# EAGLE schematic node6.9.14-frontend (EAGLE 5.10)
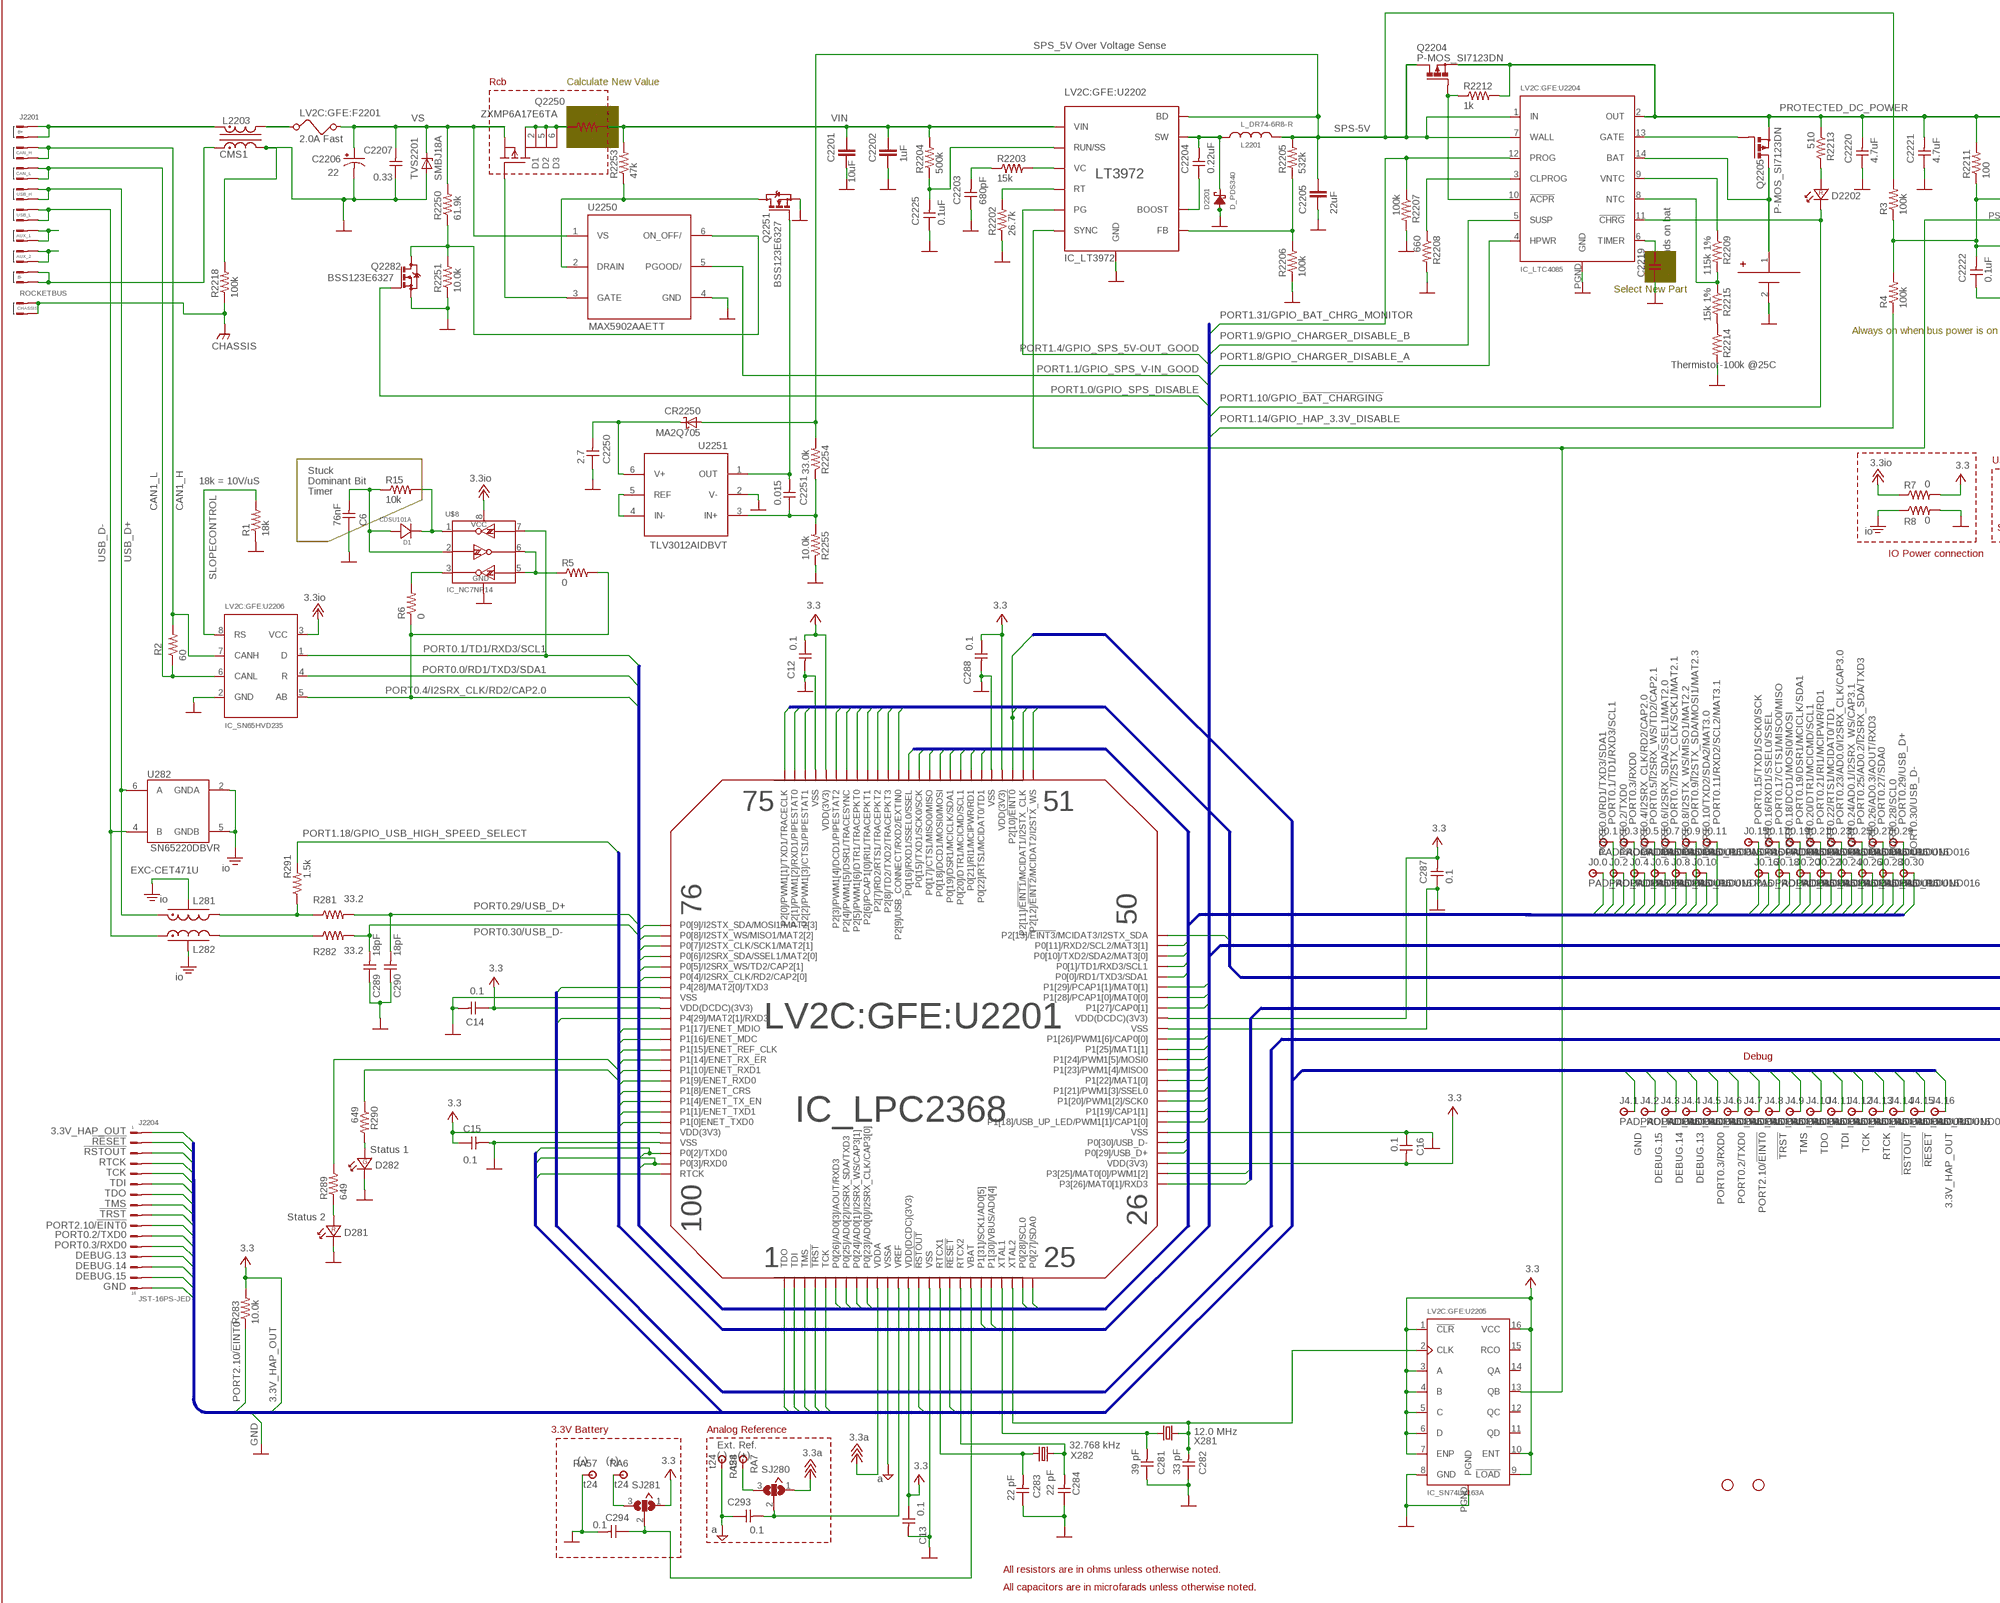
[diagram p0: schematic, sheet 1, part 1 of 2]
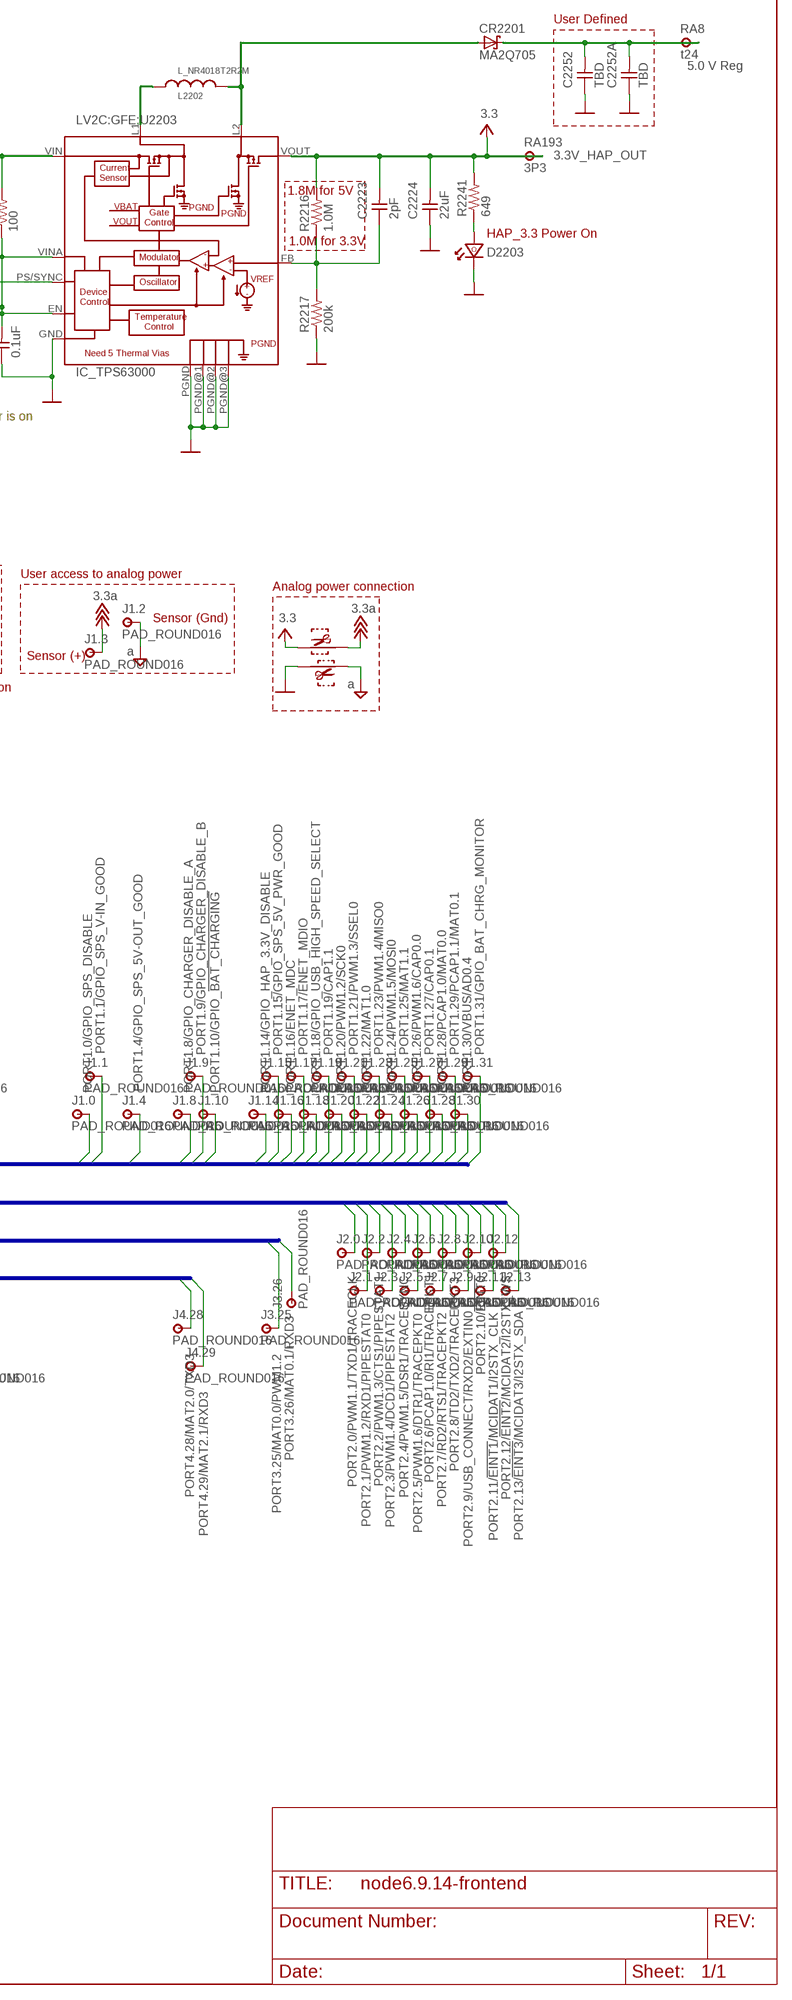
[diagram p1: schematic, sheet 1, part 2 of 2]

## Parts
B1  BATTERY_SINGLE_CELL_2MM  [2MM-1X2-HEADER]
C6  76nF  CAP-NP0805  [C0805]
C12  0.1  CAP-NP0603  [C0603]
C13  0.1  CAP-NP0603  [C0603]
C14  0.1  CAP-NP0603  [C0603]
C15  0.1  CAP-NP0603  [C0603]
C16  0.1  CAP-NP0603  [C0603]
C281  39 pF  CAP-NP0603  [C0603]
C282  33 pF  CAP-NP0603  [C0603]
C283  22 pF  CAP-NP0603  [C0603]
C284  22 pF  CAP-NP0603  [C0603]
C287  0.1  CAP-NP0603  [C0603]
C288  0.1  CAP-NP0603  [C0603]
C289  18pF  CAP-NP0603  [C0603]
C290  18pF  CAP-NP0603  [C0603]
C293  0.1  CAP-NP0603  [C0603]
C294  0.1  CAP-NP0603  [C0603]
C2201  10uF  C-EUC1210  [C1210]
C2202  1uF  C-EUC1206  [C1206]
C2203  680pF  CAP-NP0603  [C0603]
C2204  0.22uF  CAP-NP0603  [C0603]
C2205  22uF  C-EUC1210  [C1210]
C2206  22  CPOL-USD/7343-31R  [D/7343-31R]
C2207  0.33  CAP-NP0805  [C0805]
C2219  depends on bat  CAP-NP0603  [C0603]
C2220  4.7uF  CAP-NP0805  [C0805]
C2221  4.7uF  CAP-NP0805  [C0805]
C2222  0.1uF  CAP-NP0603  [C0603]
C2223  2pF  CAP-NP0805  [C0805]
C2224  22uF  CAP-NP0805  [C0805]
C2225  0.1uF  CAP-NP0603  [C0603]
C2250  2.7  CAP-NP0603  [C0603]
C2251  0.015  CAP-NP0603  [C0603]
C2252  TBD  CAP-NP0805  [C0805]
C2252A  TBD  CAP-NP1206  [C1206]
CR2201  MA2Q705  [NMINIP2-J1]
CR2250  MA2Q705  [NMINIP2-J1]
D1  CDSU101A  DIODE_SILICON-0603  [0603-DIODE]
D281  LED-RED-0603  [0603-DIODE]
D282  LED-GRN-  [0603-DIODE]
D2201  D_PDS340  [D_POWERDI5]
D2202  LED-RED-0805  [0805-DIODE]
D2203  LED-ORG-0805  [0805-DIODE]
J0.0  PAD_ROUND016  [PAD_ROUND-APC-FREE_0.1/016]
J0.1  PAD_ROUND016  [PAD_ROUND-APC-FREE_0.1/016]
J0.2  PAD_ROUND016  [PAD_ROUND-APC-FREE_0.1/016]
J0.3  PAD_ROUND016  [PAD_ROUND-APC-FREE_0.1/016]
J0.4  PAD_ROUND016  [PAD_ROUND-APC-FREE_0.1/016]
J0.5  PAD_ROUND016  [PAD_ROUND-APC-FREE_0.1/016]
J0.6  PAD_ROUND016  [PAD_ROUND-APC-FREE_0.1/016]
J0.7  PAD_ROUND016  [PAD_ROUND-APC-FREE_0.1/016]
J0.8  PAD_ROUND016  [PAD_ROUND-APC-FREE_0.1/016]
J0.9  PAD_ROUND016  [PAD_ROUND-APC-FREE_0.1/016]
J0.10  PAD_ROUND016  [PAD_ROUND-APC-FREE_0.1/016]
J0.11  PAD_ROUND016  [PAD_ROUND-APC-FREE_0.1/016]
J0.15  PAD_ROUND016  [PAD_ROUND-APC-FREE_0.1/016]
J0.16  PAD_ROUND016  [PAD_ROUND-APC-FREE_0.1/016]
J0.17  PAD_ROUND016  [PAD_ROUND-APC-FREE_0.1/016]
J0.18  PAD_ROUND016  [PAD_ROUND-APC-FREE_0.1/016]
J0.19  PAD_ROUND016  [PAD_ROUND-APC-FREE_0.1/016]
J0.20  PAD_ROUND016  [PAD_ROUND-APC-FREE_0.1/016]
J0.21  PAD_ROUND016  [PAD_ROUND-APC-FREE_0.1/016]
J0.22  PAD_ROUND016  [PAD_ROUND-APC-FREE_0.1/016]
J0.23  PAD_ROUND016  [PAD_ROUND-APC-FREE_0.1/016]
J0.24  PAD_ROUND016  [PAD_ROUND-APC-FREE_0.1/016]
J0.25  PAD_ROUND016  [PAD_ROUND-APC-FREE_0.1/016]
J0.26  PAD_ROUND016  [PAD_ROUND-APC-FREE_0.1/016]
J0.27  PAD_ROUND016  [PAD_ROUND-APC-FREE_0.1/016]
J0.28  PAD_ROUND016  [PAD_ROUND-APC-FREE_0.1/016]
J0.29  PAD_ROUND016  [PAD_ROUND-APC-FREE_0.1/016]
J0.30  PAD_ROUND016  [PAD_ROUND-APC-FREE_0.1/016]
J1.0  PAD_ROUND016  [PAD_ROUND-APC-FREE_0.1/016]
J1.1  PAD_ROUND016  [PAD_ROUND-APC-FREE_0.1/016]
J1.2  PAD_ROUND016  [PAD_ROUND-APC-FREE_0.1/016]
J1.3  PAD_ROUND016  [PAD_ROUND-APC-FREE_0.1/016]
J1.4  PAD_ROUND016  [PAD_ROUND-APC-FREE_0.1/016]
J1.8  PAD_ROUND016  [PAD_ROUND-APC-FREE_0.1/016]
J1.9  PAD_ROUND016  [PAD_ROUND-APC-FREE_0.1/016]
J1.10  PAD_ROUND016  [PAD_ROUND-APC-FREE_0.1/016]
J1.14  PAD_ROUND016  [PAD_ROUND-APC-FREE_0.1/016]
J1.15  PAD_ROUND016  [PAD_ROUND-APC-FREE_0.1/016]
J1.16  PAD_ROUND016  [PAD_ROUND-APC-FREE_0.1/016]
J1.17  PAD_ROUND016  [PAD_ROUND-APC-FREE_0.1/016]
J1.18  PAD_ROUND016  [PAD_ROUND-APC-FREE_0.1/016]
J1.19  PAD_ROUND016  [PAD_ROUND-APC-FREE_0.1/016]
J1.20  PAD_ROUND016  [PAD_ROUND-APC-FREE_0.1/016]
J1.21  PAD_ROUND016  [PAD_ROUND-APC-FREE_0.1/016]
J1.22  PAD_ROUND016  [PAD_ROUND-APC-FREE_0.1/016]
J1.23  PAD_ROUND016  [PAD_ROUND-APC-FREE_0.1/016]
J1.24  PAD_ROUND016  [PAD_ROUND-APC-FREE_0.1/016]
J1.25  PAD_ROUND016  [PAD_ROUND-APC-FREE_0.1/016]
J1.26  PAD_ROUND016  [PAD_ROUND-APC-FREE_0.1/016]
J1.27  PAD_ROUND016  [PAD_ROUND-APC-FREE_0.1/016]
J1.28  PAD_ROUND016  [PAD_ROUND-APC-FREE_0.1/016]
J1.29  PAD_ROUND016  [PAD_ROUND-APC-FREE_0.1/016]
J1.30  PAD_ROUND016  [PAD_ROUND-APC-FREE_0.1/016]
J1.31  PAD_ROUND016  [PAD_ROUND-APC-FREE_0.1/016]
J2.0  PAD_ROUND016  [PAD_ROUND-APC-FREE_0.1/016]
J2.1  PAD_ROUND016  [PAD_ROUND-APC-FREE_0.1/016]
J2.2  PAD_ROUND016  [PAD_ROUND-APC-FREE_0.1/016]
J2.3  PAD_ROUND016  [PAD_ROUND-APC-FREE_0.1/016]
J2.4  PAD_ROUND016  [PAD_ROUND-APC-FREE_0.1/016]
J2.5  PAD_ROUND016  [PAD_ROUND-APC-FREE_0.1/016]
J2.6  PAD_ROUND016  [PAD_ROUND-APC-FREE_0.1/016]
J2.7  PAD_ROUND016  [PAD_ROUND-APC-FREE_0.1/016]
J2.8  PAD_ROUND016  [PAD_ROUND-APC-FREE_0.1/016]
J2.9  PAD_ROUND016  [PAD_ROUND-APC-FREE_0.1/016]
J2.10  PAD_ROUND016  [PAD_ROUND-APC-FREE_0.1/016]
J2.11  PAD_ROUND016  [PAD_ROUND-APC-FREE_0.1/016]
J2.12  PAD_ROUND016  [PAD_ROUND-APC-FREE_0.1/016]
J2.13  PAD_ROUND016  [PAD_ROUND-APC-FREE_0.1/016]
J3.25  PAD_ROUND016  [PAD_ROUND-APC-FREE_0.1/016]
J3.26  PAD_ROUND016  [PAD_ROUND-APC-FREE_0.1/016]
J4.1  PAD_ROUND016  [PAD_ROUND-APC-FREE_0.1/016]
J4.2  PAD_ROUND016  [PAD_ROUND-APC-FREE_0.1/016]
J4.3  PAD_ROUND016  [PAD_ROUND-APC-FREE_0.1/016]
J4.4  PAD_ROUND016  [PAD_ROUND-APC-FREE_0.1/016]
J4.5  PAD_ROUND016  [PAD_ROUND-APC-FREE_0.1/016]
J4.6  PAD_ROUND016  [PAD_ROUND-APC-FREE_0.1/016]
J4.7  PAD_ROUND016  [PAD_ROUND-APC-FREE_0.1/016]
J4.8  PAD_ROUND016  [PAD_ROUND-APC-FREE_0.1/016]
J4.9  PAD_ROUND016  [PAD_ROUND-APC-FREE_0.1/016]
J4.10  PAD_ROUND016  [PAD_ROUND-APC-FREE_0.1/016]
J4.11  PAD_ROUND016  [PAD_ROUND-APC-FREE_0.1/016]
J4.12  PAD_ROUND016  [PAD_ROUND-APC-FREE_0.1/016]
J4.13  PAD_ROUND016  [PAD_ROUND-APC-FREE_0.1/016]
J4.14  PAD_ROUND016  [PAD_ROUND-APC-FREE_0.1/016]
J4.15  PAD_ROUND016  [PAD_ROUND-APC-FREE_0.1/016]
J4.16  PAD_ROUND016  [PAD_ROUND-APC-FREE_0.1/016]
J4.28  PAD_ROUND016  [PAD_ROUND-APC-FREE_0.1/016]
J4.29  PAD_ROUND016  [PAD_ROUND-APC-FREE_0.1/016]
J2201  ROCKETBUS  [ROCKETBUS-PKG]
J2204  JST-16PS-JED  [JST-16PS-JED]
J-CUT3  J_CUT_1206  [ZJ1206B]
J-CUT4  J_CUT_1206  [ZJ1206B]
JP1  STAND-OFF  [STAND-OFF]
JP2  STAND-OFF  [STAND-OFF]
L281  EXC-CET471U  FILTER_EMI-EXC-CET  [EXC-CET]
L282  FILTER_EMI-EXC-CET  [EXC-CET]
L2201  L_DR74-6R8-R  [L-DR74]
L2202  L_NR4018T2R2M  [L_NR4018]
L2203  CMS1  COIL_CMS1  [CMS1]
LV2C:GFE:F2201  2.0A Fast  FUSE1206  [1206]
LV2C:GFE:U2201  IC_LPC2368  [LQFP100]
LV2C:GFE:U2202  IC_LT3972  [DFN-10]
LV2C:GFE:U2203  IC_TPS63000  [SON-10]
LV2C:GFE:U2204  IC_LTC4085  [DFN-14]
LV2C:GFE:U2205  IC_SN74LV163A  [QFN-16]
LV2C:GFE:U2206  IC_SN65HVD235  [DR-PDSO-G8]
Q2204  P-MOS_SI7123DN  [1212-8_POWERPAK]
Q2205  P-MOS_SI7123DN  [1212-8_POWERPAK]
Q2250  ZXMP6A17E6TA  FET_ZXMP6A17E6  [SOT23-6]
Q2251  BSS123E6327  IC_BSS123  [SOT23-3]
Q2282  BSS123E6327  IC_BSS123  [SOT23-3]
R1  18k  R-US_R0603  [R0603]
R2  60  R-US_R0603  [R0603]
R3  100k  R-US_R1206  [R1206]
R4  100k  R-US_R1206  [R1206]
R5  0  R-US_R0603  [R0603]
R6  0  R-US_R0603  [R0603]
R7  0  R-US_R0603  [R0603]
R8  0  R-US_R0603  [R0603]
R15  10k  R-US_R0603  [R0603]
R281  33.2  R-US_R0603  [R0603]
R282  33.2  R-US_R0603  [R0603]
R283  10.0k  R-US_R0603  [R0603]
R289  649  R-US_R0603  [R0603]
R290  649  R-US_R0603  [R0603]
R291  1.5k  R-US_R0603  [R0603]
R2202  26.7k  R-US_R0603  [R0603]
R2203  15k  R-US_R0603  [R0603]
R2204  500k  R-US_R0603  [R0603]
R2205  532k  R-US_R0603  [R0603]
R2206  100k  R-US_R0603  [R0603]
R2207  100k  R-US_R0603  [R0603]
R2208  660  R-US_R0603  [R0603]
R2209  115k 1%  R-US_R0603  [R0603]
R2211  100  R-US_R0603  [R0603]
R2212  1k  R-US_R0603  [R0603]
R2213  510  R-US_R0603  [R0603]
R2214  Thermistor-100k @25C  R-US_R0805  [R0805]
R2215  15k 1%  R-US_R0603  [R0603]
R2216  1.0M  R-US_R0603  [R0603]
R2217  200k  R-US_R0603  [R0603]
R2218  100k  R-US_R0805  [R0805]
R2241  649  R-US_R0603  [R0603]
R2250  61.9k  R-US_R0603  [R0603]
R2251  10.0k  R-US_R0603  [R0603]
R2252  0.82  R-US_R0805  [R0805]
R2253  47k  R-US_R0603  [R0603]
R2254  33.0k  R-US_R0603  [R0603]
R2255  10.0k  R-US_R0603  [R0603]
RA6  t24  PAD_ROUND016  [PAD_ROUND-APC-FREE_0.1/016]
RA7  t24  PAD_ROUND016  [PAD_ROUND-APC-FREE_0.1/016]
RA8  t24  PAD_ROUND016  [PAD_ROUND-APC-FREE_0.1/016]
RA57  t24  PAD_ROUND016  [PAD_ROUND-APC-FREE_0.1/016]
RA58  t24  PAD_ROUND016  [PAD_ROUND-APC-FREE_0.1/016]
RA193  3P3  PAD_ROUND016  [PAD_ROUND-APC-FREE_0.1/016]
SJ280  JUMPER_SJ2WSJ_2W_DEF  [SJ_2W]
SJ281  JUMPER_SJ2WSJ_2W_DEF  [SJ_2W]
TVS2201  SMBJ18A  ZENER-DIODESMB  [SMB]
U282  SN65220DBVR  IC_SN65220  [SOT23-6]
U2250  MAX5902AAETT  IC_MAX5902  [SOT23-6]
U2251  TLV3012AIDBVT  IC_TLV3012  [SOT23-6]
U$8  IC_NC7NP14  [MICROPAK-8]
X281  12.0 MHz  XTAL_CS10  [CS10]
X282  32.768 kHz  XTAL_CM415  [CM415]

## Nets
3.3V_HAP_OUT: C12.1 C13.1 C14.1 C15.1 C16.2 C287.2 C288.1 C2223.2 C2224.2 J4.16.PAD J2204.1 J-CUT3.2(P1) LV2C:GFE:U2201.VDD(3V3) LV2C:GFE:U2201.VDD(3V3)@1(VDD(3V3)) LV2C:GFE:U2201.VDD(3V3)@2(VDD(3V3)) LV2C:GFE:U2201.VDD(3V3)@3(VDD(3V3)) LV2C:GFE:U2201.VDD(DCDC)(3V3) LV2C:GFE:U2201.VDD(DCDC)(3V3)@1(VDD(DCDC)(3V3)) LV2C:GFE:U2201.VDD(DCDC)(3V3)@2(VDD(DCDC)(3V3)) LV2C:GFE:U2203.VOUT LV2C:GFE:U2205.1(!CLR!) LV2C:GFE:U2205.3(A) LV2C:GFE:U2205.4(B) LV2C:GFE:U2205.5(C) LV2C:GFE:U2205.6(D) LV2C:GFE:U2205.7(ENP) LV2C:GFE:U2205.9(!LOAD!) LV2C:GFE:U2205.10(ENT) LV2C:GFE:U2205.16(VCC) R7.2 R283.2 R2216.2 R2241.2 RA193.PAD SJ281.1 ; supply symbol labelled 3.3
!RESET!: J4.15.PAD J2204.2 LV2C:GFE:U2201.#RESET(!RESET!)
!RSTOUT!: J4.14.PAD J2204.3 LV2C:GFE:U2201.#RSTOUT(!RSTOUT!)
!SPS_POWER_PRESENT!: LV2C:GFE:U2204.10(!ACPR!) Q2204.4(G) R2212.1
!TRST!: J4.8.PAD J2204.9 LV2C:GFE:U2201.#TRST(!TRST!)
A_3P3: J1.3.PAD J-CUT3.1(P0) LV2C:GFE:U2201.VDDA SJ280.1 ; supply symbol labelled 3.3a
A_GND: C293.1 J1.2.PAD J-CUT4.2(P1) LV2C:GFE:U2201.VSSA RA58.PAD ; supply symbol labelled a
AUX_1.2: J2201.AUX_1@1(AUX_1) J2201.AUX_1@2(AUX_1)
AUX_2.2: J2201.AUX_2@1(AUX_2) J2201.AUX_2@2(AUX_2)
BATTERY_CHARGE: B1.1(B+) LV2C:GFE:U2204.14(BAT) Q2205.5-6-7-8(D)
BATTERY_CONNECT_CONTROL: LV2C:GFE:U2204.13(GATE) Q2205.4(G)
BIAS_VOLTS_FOR_NTC_THERMISTOR: LV2C:GFE:U2204.9(VNTC) R2209.1
BIN: L2203.3 LV2C:GFE:F2201.1
CAN1_H: J2201.CAN_H@1(CAN_H) J2201.CAN_H@2(CAN_H) LV2C:GFE:U2206.7(CANH) R2.2
CAN1_L: J2201.CAN_L@1(CAN_L) J2201.CAN_L@2(CAN_L) LV2C:GFE:U2206.6(CANL) R2.1
CHARGE_TIMER: C2219.2 LV2C:GFE:U2204.6(TIMER)
CHASSIS: J2201.CHASSIS@1(CHASSIS) J2201.CHASSIS@2(CHASSIS) R2218.1
CPU_VBAT: C294.1 LV2C:GFE:U2201.VBAT SJ281.2
CPU_VREF: C293.2 LV2C:GFE:U2201.VREF SJ280.2
CPU_XTAL1: C281.2 LV2C:GFE:U2201.XTAL1 X281.P$1
CPU_XTAL2: C282.2 LV2C:GFE:U2201.XTAL2 LV2C:GFE:U2205.2(CLK) X281.P$2
DEBUG.13: J4.4.PAD J2204.13
DEBUG.14: J4.3.PAD J2204.14
DEBUG.15: J4.2.PAD J2204.15
DOMINANT_BIT_STUCK_WHEN_HIGH: C6.2 D1.A(ANODE) R15.1 U$8.2(3A)
EXT_VBAT: RA6.PAD SJ281.3
EXT_VREF: RA7.PAD SJ280.3
FB: C2223.1 LV2C:GFE:U2203.FB R2216.1 R2217.2
GND: B1.2(B-) C6.1 C12.2 C13.2 C14.2 C15.2 C16.1 C281.1 C282.1 C283.1 C284.1 C287.1 C288.2 C289.1 C290.1 C294.2 C2201.2 C2202.2 C2203.1 C2205.2 C2206.- C2207.1 C2219.1 C2220.1 C2221.1 C2222.1 C2224.1 C2225.1 C2250.1 C2252.1 C2252A.1 D281.K(CATHODE) D282.K(CATHODE) D2201.ANODE1 D2201.ANODE2 D2203.2(CATHODE)(CATHODE) J4.1.PAD J2204.16 J-CUT4.1(P0) L2203.2 LV2C:GFE:U2201.VSS LV2C:GFE:U2201.VSS@1(VSS) LV2C:GFE:U2201.VSS@2(VSS) LV2C:GFE:U2201.VSS@3(VSS) LV2C:GFE:U2201.VSS@4(VSS) LV2C:GFE:U2201.VSS@5(VSS) LV2C:GFE:U2201.VSS@6(VSS) LV2C:GFE:U2202.GND LV2C:GFE:U2203.GND LV2C:GFE:U2203.PGND LV2C:GFE:U2203.PGND@1(PGND) LV2C:GFE:U2203.PGND@2(PGND) LV2C:GFE:U2203.PGND@3(PGND) LV2C:GFE:U2204.PGND(GND) LV2C:GFE:U2205.8(GND) LV2C:GFE:U2205.PGND LV2C:GFE:U2206.2(GND) Q2251.2(S) Q2282.2(S) R1.1 R8.2 R2202.1 R2206.1 R2207.2 R2208.2 R2214.2 R2217.1 R2218.2 R2251.1 R2255.1 RA57.PAD TVS2201.A U2250.4(GND) U2251.2(V-) U$8.4(GND)
IN+: C2251.1 R2254.1 R2255.2 U2251.3(IN+)
IN_CURRENT_LIMIT_PROG: LV2C:GFE:U2204.3(CLPROG) R2208.1
INV-INV: R5.1 U$8.5(2A) U$8.6(3Y)
INV_DATA: D1.K(CATHODE) R15.2 U$8.1(1Y)
IO_3P3: LV2C:GFE:U2206.3(VCC) R7.1 U$8.8(VCC) ; supply symbol labelled 3.3io
IO_GND: L281.C(COMMON) L282.C(COMMON) R8.1 U282.2(GNDA) U282.5(GNDB) ; supply symbol labelled io
L_IN: L2202.1 LV2C:GFE:U2203.L1
L_OUT: CR2201.A L2202.2 LV2C:GFE:U2203.L2
LED200_A: D282.A(ANODE) R290.2
MAX_UVLO: Q2282.3(D) R2250.1 R2251.2 U2250.6(ON_OFF/)
N$2: J2201.B+@1(B+) J2201.B+@2(B+) L2203.4
N$3: LV2C:GFE:U2202.VC R2203.2
N$4: LV2C:GFE:U2202.RT R2202.2
N$5: C2203.2 R2203.1
N$6: R6.2 U$8.3(2Y)
N$7: D2202.1(ANODE)(ANODE) R2213.2
N$10: R2214.1 R2215.2
N_DRAIN: Q2251.3(D) R2253.1 U2250.2(DRAIN)
N_GATE: C2251.2 Q2251.1(G) U2251.1(OUT)
NTC_INPUT_FROM_BATTERY: LV2C:GFE:U2204.8(NTC) R2209.2 R2215.1
P_GATE: Q2250.3(G) U2250.3(GATE)
PIC_LAMP: D281.A(ANODE) R289.1
PORT0.0/RD1/TXD3/SDA1: J0.0.PAD LV2C:GFE:U2201.P0[0]/RD1/TXD3/SDA1 LV2C:GFE:U2206.4(R)
PORT0.1/TD1/RXD3/SCL1: J0.1.PAD LV2C:GFE:U2201.P0[1]/TD1/RXD3/SCL1 LV2C:GFE:U2206.1(D) U$8.7(1A)
PORT0.2/TXD0: J0.2.PAD J4.6.PAD J2204.11 LV2C:GFE:U2201.P0[2]/TXD0
PORT0.3/RXD0: J0.3.PAD J4.5.PAD J2204.12 LV2C:GFE:U2201.P0[3]/RXD0
PORT0.4/I2SRX_CLK/RD2/CAP2.0: J0.4.PAD LV2C:GFE:U2201.P0[4]/I2SRX_CLK/RD2/CAP2[0] LV2C:GFE:U2206.5(AB) R5.2 R6.1
PORT0.5/I2SRX_WS/TD2/CAP2.1: J0.5.PAD LV2C:GFE:U2201.P0[5]/I2SRX_WS/TD2/CAP2[1]
PORT0.6/I2SRX_SDA/SSEL1/MAT2.0: J0.6.PAD LV2C:GFE:U2201.P0[6]/I2SRX_SDA/SSEL1/MAT2[0]
PORT0.7/I2STX_CLK/SCK1/MAT2.1: J0.7.PAD LV2C:GFE:U2201.P0[7]/I2STX_CLK/SCK1/MAT2[1]
PORT0.8/I2STX_WS/MISO1/MAT2.2: J0.8.PAD LV2C:GFE:U2201.P0[8]/I2STX_WS/MISO1/MAT2[2]
PORT0.9/I2STX_SDA/MOSI1/MAT2.3: J0.9.PAD LV2C:GFE:U2201.P0[9]/I2STX_SDA/MOSI1/MAT2[3]
PORT0.10/TXD2/SDA2/MAT3.0: J0.10.PAD LV2C:GFE:U2201.P0[10]/TXD2/SDA2/MAT3[0]
PORT0.11/RXD2/SCL2/MAT3.1: J0.11.PAD LV2C:GFE:U2201.P0[11]/RXD2/SCL2/MAT3[1]
PORT0.15/TXD1/SCK0/SCK: J0.15.PAD LV2C:GFE:U2201.P0[15]/TXD1/SCK0/SCK
PORT0.16/RXD1/SSEL0/SSEL: J0.16.PAD LV2C:GFE:U2201.P0[16]/RXD1/SSEL0/SSEL
PORT0.17/CTS1/MISO0/MISO: J0.17.PAD LV2C:GFE:U2201.P0[17]/CTS1/MISO0/MISO
PORT0.18/DCD1/MOSI0/MOSI: J0.18.PAD LV2C:GFE:U2201.P0[18]/DCD1/MOSI0/MOSI
PORT0.19/DSR1/MCICLK/SDA1: J0.19.PAD LV2C:GFE:U2201.P0[19]/DSR1/MCICLK/SDA1
PORT0.20/DTR1/MCICMD/SCL1: J0.20.PAD LV2C:GFE:U2201.P0[20]/DTR1/MCICMD/SCL1
PORT0.21/RI1/MCIPWR/RD1: J0.21.PAD LV2C:GFE:U2201.P0[21]/RI1/MCIPWR/RD1
PORT0.22/RTS1/MCIDAT0/TD1: J0.22.PAD LV2C:GFE:U2201.P0[22]/RTS1/MCIDAT0/TD1
PORT0.23/AD0.0/I2SRX_CLK/CAP3.0: J0.23.PAD LV2C:GFE:U2201.P0[23]/AD0[0]/I2SRX_CLK/CAP3[0]
PORT0.24/AD0.1/I2SRX_WS/CAP3.1: J0.24.PAD LV2C:GFE:U2201.P0[24]/AD0[1]/I2SRX_WS/CAP3[1]
PORT0.25/AD0.2/I2SRX_SDA/TXD3: J0.25.PAD LV2C:GFE:U2201.P0[25]/AD0[2]/I2SRX_SDA/TXD3
PORT0.26/AD0.3/AOUT/RXD3: J0.26.PAD LV2C:GFE:U2201.P0[26]/AD0[3]/AOUT/RXD3
PORT0.27/SDA0: J0.27.PAD LV2C:GFE:U2201.P0[27]/SDA0
PORT0.28/SCL0: J0.28.PAD LV2C:GFE:U2201.P0[28]/SCL0
PORT0.29/USB_D+: C290.2 J0.29.PAD LV2C:GFE:U2201.P0[29]/USB_D+ R281.2
PORT0.30/USB_D-: C289.2 J0.30.PAD LV2C:GFE:U2201.P0[30]/USB_D- R282.2
PORT1.0/GPIO_SPS_DISABLE: J1.0.PAD LV2C:GFE:U2201.P1[0]/ENET_TXD0(P1[0]ENET_TXD0) Q2282.1(G)
PORT1.1/GPIO_SPS_V-IN_GOOD: J1.1.PAD LV2C:GFE:U2201.P1[1]/ENET_TXD1 U2250.5(PGOOD/)
PORT1.4/GPIO_SPS_5V-OUT_GOOD: J1.4.PAD LV2C:GFE:U2201.P1[4]/ENET_TX_EN LV2C:GFE:U2202.PG
PORT1.8/GPIO_CHARGER_DISABLE_A: J1.8.PAD LV2C:GFE:U2201.P1[8]/ENET_CRS LV2C:GFE:U2204.4(HPWR)
PORT1.9/GPIO_CHARGER_DISABLE_B: J1.9.PAD LV2C:GFE:U2201.P1[9]/ENET_RXD0 LV2C:GFE:U2204.5(SUSP)
PORT1.10/GPIO_!BAT_CHARGING!: D2202.2(CATHODE)(CATHODE) J1.10.PAD LV2C:GFE:U2201.P1[10]/ENET_RXD1 LV2C:GFE:U2204.11(!CHRG!)
PORT1.14/GPIO_HAP_3.3V_DISABLE: J1.14.PAD LV2C:GFE:U2201.P1[14]/ENET_RX_ER R4.1
PORT1.15/GPIO_SPS_5V_PWR_GOOD: J1.15.PAD LV2C:GFE:U2201.P1[15]/ENET_REF_CLK
PORT1.16/ENET_MDC: J1.16.PAD LV2C:GFE:U2201.P1[16]/ENET_MDC R290.1
PORT1.17/ENET_MDIO: J1.17.PAD LV2C:GFE:U2201.P1[17]/ENET_MDIO R289.2
PORT1.18/GPIO_USB_HIGH_SPEED_SELECT: J1.18.PAD LV2C:GFE:U2201.P1[18]/USB_UP_LED/PWM1[1]/CAP1[0] R291.2
PORT1.19/CAP1.1: J1.19.PAD LV2C:GFE:U2201.P1[19]/CAP1[1]
PORT1.20/PWM1.2/SCK0: J1.20.PAD LV2C:GFE:U2201.P1[20]/PWM1[2]/SCK0
PORT1.21/PWM1.3/SSEL0: J1.21.PAD LV2C:GFE:U2201.P1[21]/PWM1[3]/SSEL0
PORT1.22/MAT1.0: J1.22.PAD LV2C:GFE:U2201.P1[22]MAT1[0](P1[22]/MAT1[0])
PORT1.23/PWM1.4/MISO0: J1.23.PAD LV2C:GFE:U2201.P1[23]/PWM1[4]/MISO0
PORT1.24/PWM1.5/MOSI0: J1.24.PAD LV2C:GFE:U2201.P1[24]/PWM1[5]/MOSI0
PORT1.25/MAT1.1: J1.25.PAD LV2C:GFE:U2201.P1[25]/MAT1[1]
PORT1.26/PWM1.6/CAP0.0: J1.26.PAD LV2C:GFE:U2201.P1[26]/PWM1[6]/CAP0[0]
PORT1.27/CAP0.1: J1.27.PAD LV2C:GFE:U2201.P1[27]/CAP0[1]
PORT1.28/PCAP1.0/MAT0.0: J1.28.PAD LV2C:GFE:U2201.P1[28]/PCAP1[0]/MAT0[0]
PORT1.29/PCAP1.1/MAT0.1: J1.29.PAD LV2C:GFE:U2201.P1[29]/PCAP1[1]/MAT0[1]
PORT1.30/VBUS/AD0.4: J1.30.PAD LV2C:GFE:U2201.P1[30]/VBUS/AD0[4]
PORT1.31/GPIO_BAT_CHRG_MONITOR: J1.31.PAD LV2C:GFE:U2201.P1[31]/SCK1/AD0[5] LV2C:GFE:U2204.12(PROG) R2207.1
PORT2.0/PWM1.1/TXD1/TRACECLK: J2.0.PAD LV2C:GFE:U2201.P2[0]/PWM1[1]/TXD1/TRACECLK
PORT2.1/PWM1.2/RXD1/PIPESTAT0: J2.1.PAD LV2C:GFE:U2201.P2[1]/PWM1[2]/RXD1/PIPESTAT0
PORT2.2/PWM1.3/CTS1/PIPESTAT1: J2.2.PAD LV2C:GFE:U2201.P2[2]/PWM1[3]/CTS1/PIPESTAT1
PORT2.3/PWM1.4/DCD1/PIPESTAT2: J2.3.PAD LV2C:GFE:U2201.P2[3]/PWM1[4]/DCD1/PIPESTAT2
PORT2.4/PWM1.5/DSR1/TRACESYNC: J2.4.PAD LV2C:GFE:U2201.P2[4]/PWM1[5]/DSR1/TRACESYNC
PORT2.5/PWM1.6/DTR1/TRACEPKT0: J2.5.PAD LV2C:GFE:U2201.P2[5]/PWM1[6]/DTR1/TRACEPKT0
PORT2.6/PCAP1.0/RI1/TRACEPKT1: J2.6.PAD LV2C:GFE:U2201.P2[6]/PCAP1[0]/RI1/TRACEPKT1
PORT2.7/RD2/RTS1/TRACEPKT2: J2.7.PAD LV2C:GFE:U2201.P2[7]/RD2/RTS1/TRACEPKT2
PORT2.8/TD2/TXD2/TRACEPKT3: J2.8.PAD LV2C:GFE:U2201.P2[8]/TD2/TXD2/TRACEPKT3
PORT2.9/USB_CONNECT/RXD2/EXTIN0: J2.9.PAD LV2C:GFE:U2201.P2[9]/USB_CONNECT/RXD2/EXTIN0
PORT2.10/!EINT0!: J2.10.PAD J4.7.PAD J2204.10 LV2C:GFE:U2201.P2[10]/#EINT0(P2[10]/!EINT0!) R283.1
PORT2.11/!EINT1!/MCIDAT1/I2STX_CLK: J2.11.PAD LV2C:GFE:U2201.P2[11]/#EINT1/MCIDAT1/I2STX_CLK(P2[11]/!EINT1!/MCIDAT1/I2STX_CLK)
PORT2.12/!EINT2!/MCIDAT2/I2STX_WS: J2.12.PAD LV2C:GFE:U2201.P2[12]/#EINT2/MCIDAT2/I2STX_WS(P2[12]/!EINT2!/MCIDAT2/I2STX_WS)
PORT2.13/!EINT3!/MCIDAT3/I2STX_SDA: J2.13.PAD LV2C:GFE:U2201.P2[13]/#EINT3/MCIDAT3/I2STX_SDA(P2[13]/!EINT3!/MCIDAT3/I2STX_SDA)
PORT3.25/MAT0.0/PWM1.2: J3.25.PAD LV2C:GFE:U2201.P3[25]/MAT0[0]/PWM1[2]
PORT3.26/MAT0.1/RXD3: J3.26.PAD LV2C:GFE:U2201.P3[26]/MAT0[1]/PWM1[3](P3[26]/MAT0[1]/RXD3)
PORT4.28/MAT2.0/TXD3: J4.28.PAD LV2C:GFE:U2201.P4[28]/MAT2[0]/TXD3
PORT4.29/MAT2.1/RXD3: J4.29.PAD LV2C:GFE:U2201.P4[29]/MAT2[1]/RXD3
PROTECTED_DC_POWER: C2220.2 C2221.2 LV2C:GFE:U2203.VIN LV2C:GFE:U2204.2(OUT) Q2204.1-2-3(S) Q2205.1-2-3(S) R2211.2 R2212.2 R2213.1
REF: U2251.4(IN-) U2251.5(REF)
RTC_XTAL-A: C283.2 LV2C:GFE:U2201.RTCX1 X282.P$2
RTC_XTAL-B: C284.2 LV2C:GFE:U2201.RTCX2 X282.P$1
RTCK: J4.13.PAD J2204.4 LV2C:GFE:U2201.RTCK
SH_GND: J2201.B-@1(B-) J2201.B-@2(B-) L2203.1
SLOPECONTROL: LV2C:GFE:U2206.8(RS) R1.2
SOFT_START: C2225.2 LV2C:GFE:U2202.RUN/SS R2204.1
SPS-5V: C2205.1 CR2250.A L2201.2 LV2C:GFE:U2202.BD LV2C:GFE:U2204.1(IN) LV2C:GFE:U2204.7(WALL) Q2204.5-6-7-8(D) R3.2 R2205.2 R2254.2
SPS_3P3_LED: D2203.1(ANODE)(ANODE) R2241.1
SPS_5_REG: C2252.2 C2252A.2 CR2201.C RA8.PAD
SPS_SYNC: LV2C:GFE:U2202.SYNC LV2C:GFE:U2203.PS/SYNC LV2C:GFE:U2205.13(QB)
TCK: J4.12.PAD J2204.5 LV2C:GFE:U2201.TCK
TDI: J4.11.PAD J2204.6 LV2C:GFE:U2201.TDI
TDO: J4.10.PAD J2204.7 LV2C:GFE:U2201.TDO
TMS: J4.9.PAD J2204.8 LV2C:GFE:U2201.TMS
USB_D+: J2201.USB_H@1(USB_H) J2201.USB_H@2(USB_H) L281.1 U282.6(A)
USB_D-: J2201.USB_L@1(USB_L) J2201.USB_L@2(USB_L) L282.1 U282.4(B)
USBD+: L281.2 R281.1 R291.1
USBD-: L282.2 R282.1
V+: C2250.2 CR2250.C U2251.6(V+)
V_BOOST: C2204.1 LV2C:GFE:U2202.BOOST
V_FEEDBACK: LV2C:GFE:U2202.FB R2205.1 R2206.2
V_SWITCH: C2204.2 D2201.CATHODE L2201.1 LV2C:GFE:U2202.SW
VIN: C2201.1 C2202.1 LV2C:GFE:U2202.VIN R2204.2 R2252.2 R2253.2
VINA: C2222.2 LV2C:GFE:U2203.EN LV2C:GFE:U2203.VINA R3.1 R4.2 R2211.1
VS: C2206.+ C2207.2 LV2C:GFE:F2201.2 Q2250.4(S) R2250.2 TVS2201.C U2250.1(VS)
VS_SENSE: Q2250.1(D) Q2250.2(D1) Q2250.5(D2) Q2250.6(D3) R2252.1
Unconnected: LV2C:GFE:U2205.11(QD) LV2C:GFE:U2205.12(QC) LV2C:GFE:U2205.14(QA) LV2C:GFE:U2205.15(RCO)

## Buses
3.3V_HAP_OUT,!RESET!,!RSTOUT!,RTCK,TCK,TDI,TDO,TMS,!TRST!,PORT2.10/!EINT0!,PORT0.2/TXD0,PORT0.3/RXD0,DEBUG.13,DEBUG.14,DEBUG.15,GND
PORT0.0/RD1/TXD3/SDA1,PORT0.1/TD1/RXD3/SCL1,PORT0.2/TXD0,PORT0.3/RXD0,PORT0.4/I2SRX_CLK/RD2/CAP2.0,PORT0.5/I2SRX_WS/TD2/CAP2.1,PORT0.6/I2SRX_SDA/SSEL1/MAT2.0,PORT0.7/I2STX_CLK/SCK1/MAT2.1,PORT0.8/I2STX_WS/MISO1/MAT2.2,PORT0.9/I2STX_SDA/MOSI1/MAT2.3,PORT0.10/TXD2/SDA2/MAT3.0,PORT0.11/RXD2/SCL2/MAT3.1,PORT0.15/TXD1/SCK0/SCK,PORT0.16/RXD1/SSEL0/SSEL,PORT0.17/CTS1/MISO0/MISO,PORT0.18/DCD1/MOSI0/MOSI,PORT0.19/DSR1/MCICLK/SDA1,PORT0.20/DTR1/MCICMD/SCL1,PORT0.21/RI1/MCIPWR/RD1,PORT0.22/RTS1/MCIDAT0/TD1,PORT0.23/AD0.0/I2SRX_CLK/CAP3.0,PORT0.24/AD0.1/I2SRX_WS/CAP3.1,PORT0.25/AD0.2/I2SRX_SDA/TXD3,PORT0.26/AD0.3/AOUT/RXD3,PORT0.27/SDA0,PORT0.28/SCL0,PORT0.29/USB_D+,PORT0.30/USB_D-
PORT4.28/MAT2.0/TXD3,PORT4.29/MAT2.1/RXD3
PORT2.0/PWM1.1/TXD1/TRACECLK,PORT2.1/PWM1.2/RXD1/PIPESTAT0,PORT2.2/PWM1.3/CTS1/PIPESTAT1,PORT2.3/PWM1.4/DCD1/PIPESTAT2,PORT2.4/PWM1.5/DSR1/TRACESYNC,PORT2.5/PWM1.6/DTR1/TRACEPKT0,PORT2.6/PCAP1.0/RI1/TRACEPKT1,PORT2.7/RD2/RTS1/TRACEPKT2,PORT2.8/TD2/TXD2/TRACEPKT3,PORT2.9/USB_CONNECT/RXD2/EXTIN0,PORT2.10/!EINT0!,PORT2.11/!EINT1!/MCIDAT1/I2STX_CLK,PORT2.12/!EINT2!/MCIDAT2/I2STX_WS,PORT2.13/!EINT3!/MCIDAT3/I2STX_SDA
PORT3.25/MAT0.0/PWM1.2,PORT3.26/MAT0.1/RXD3
PORT1.0/GPIO_SPS_DISABLE,PORT1.1/GPIO_SPS_V-IN_GOOD,PORT1.4/GPIO_SPS_5V-OUT_GOOD,PORT1.8/GPIO_CHARGER_DISABLE_A,PORT1.9/GPIO_CHARGER_DISABLE_B,PORT1.10/GPIO_!BAT_CHARGING!,PORT1.14/GPIO_HAP_3.3V_DISABLE,PORT1.15/GPIO_SPS_5V_PWR_GOOD,PORT1.16/ENET_MDC,PORT1.17/ENET_MDIO,PORT1.18/GPIO_USB_HIGH_SPEED_SELECT,PORT1.19/CAP1.1,PORT1.20/PWM1.2/SCK0,PORT1.21/PWM1.3/SSEL0,PORT1.22/MAT1.0,PORT1.23/PWM1.4/MISO0,PORT1.24/PWM1.5/MOSI0,PORT1.25/MAT1.1,PORT1.26/PWM1.6/CAP0.0,PORT1.27/CAP0.1,PORT1.28/PCAP1.0/MAT0.0,PORT1.29/PCAP1.1/MAT0.1,PORT1.30/VBUS/AD0.4,PORT1.31/GPIO_BAT_CHRG_MONITOR

## Notes on the sheet
- User Defined
- 5.0 V Reg
- SPS_5V Over Voltage Sense
- Rcb | Calculate New Value
- 1.8M for 5V
- HAP_3.3 Power On
- 1.0M for 3.3V
- Select New Part
- Always on when bus power is on
- User access to analog power
- Stuck | Analog power connection
- 18k = 10V/uS | Dominant Bit
- Timer
- Sensor (Gnd)
- Sensor (+)
- IO Power connection
- Debug
- Status 1
- Status 2
- 3.3V Battery | Analog Reference
- Ext. Ref.
- (-) | (+)
- (-) | (+)
- All resistors are in ohms unless otherwise noted.
- All capacitors are in microfarads unless otherwise noted.

## Library data of the parts
B1 = psas_eagle_library:BATTERY_SINGLE_CELL_2MM
C6 C12-C16 C281-C284 C287-C290 C293 C294 C2203 C2204 C2219-C2225 C2250-C2252 C2252A = node4:CAP-NP
C2201 C2202 C2205 = rcl:C-EU: CAPACITOR, European symbol
C2206 = rcl:CPOL-US: POLARIZED CAPACITOR, American symbol
C2207 = discrete-smd-ipc:CAP-NP
CR2201 CR2250 = custom:MA2Q705
D1 = psas_eagle_library:DIODE_SILICON-*: Generic Silicon Diode
D281 = psas_eagle_library:LED-RED-?: Red LED
D282 = psas_eagle_library:LED-GRN-?
D2201 = 0kaz:D_PDS340: 3A Shottky Barrier Rectifier Diode from Diodes inc. http://www.diodes.com/datasheets/ds30478.pdf
D2202 = 0psas_eagle_library:LED-RED-?: Red LED
D2203 = psas_eagle_library:LED-ORG-?
J0.0 J0.1-J0.11 J0.15-J0.30 J1.0 J1.1-J1.4 J1.8-J1.10 J1.14-J1.31 J2.0 J2.1-J2.13 J3.25 J3.26 J4.1-J4.16 J4.28 J4.29 RA6-RA8 RA57 RA58 RA193 = psas_eagle_library:PAD_ROUND: Round plated through holes of various sizes, mostly from the apc free drill list.
J2201 = rocketbus:ROCKETBUS
J2204 = node4:JST-16PS-JED: Connector 16 pin male right angle, JED series, JST corp.
J-CUT3 J-CUT4 = 0kaz:J_CUT_1206: This is a 1206 size cuttable jumper
JP1 JP2 = SparkFun:STAND-OFF: Stand Off This is the mechanical footprint for a #4 phillips button head screw. Use the keepout ring to avoid running the screw head into surrounding components. SKU : PRT-00447
L281 L282 = psas_eagle_library:FILTER_EMI: EMI fliter combines RF chokes and capacitor in pi-arrangement
L2201 = 0kaz:L_DR74-6R8-R: Coiltronics surface mount power inductor. DR74-XXX-X series. http://www.cooperbussmann.com/pdf/4a32919a-7470-4ae0-be45-b59e3a1351ef.pdf
L2202 = 0kaz:L_NR4018T2R2M: Power Inductor. Taiyo Yuden. 4mm x 4mm surface mount. Inductance = 2.2uH. DCRmax = 0.06 Ohms. Irated = 1.44A. Isat = 2.7A. http://www.yuden.co.jp/ut/product/pdf/enr4_e.pdf
L2203 = choke:COIL_CMS1: Coiltronics CMS1 series common mode choke
LV2C:GFE:F2201 = custom:FUSE: Fuse
LV2C:GFE:U2201 = 0kaz:IC_LPC2368: LPC2368 32 bit ARM7TDMI-S processor from NXP (used to be Philps) Single chip, 32 bit microcontroller, up to 512kB flash with ISP/IAP, Ethernet, USB 2.0, CAN, and 10 bit ADC/DAC. Package is 100 pins and measures 14mm x 14mm x 1.3mm with 0.5mm pitch.
LV2C:GFE:U2202 = 0kaz:IC_LT3972: 33V, 3.5A, 2.4MHz Step-Down Switching Regulator with 75uA Quiescent Current
LV2C:GFE:U2203 = 0kaz:IC_TPS63000: Buck-Boost DC-DC converter with 1.8A switches from Texas Instruments.
LV2C:GFE:U2204 = 0kaz:IC_LTC4085
LV2C:GFE:U2205 = 0kaz:IC_SN74LV163A: 4 BIT Synchronous Binary Counter, 3.3V, 50MHz clock max. Texas Instruments. http://focus.ti.com/lit/ds/symlink/sn74lv163a.pdf
LV2C:GFE:U2206 = 0kaz:IC_SN65HVD235: +3.3V CAN Transceiver with Autobaud (listen only) from TI
Q2204 Q2205 = 0kaz:P-MOS_SI7123DN: P-MOSFET Vishay Siliconx Si7123 Rdson = 10.6 milliOhm at Vgs = -4.5V Vds max = -20V, Vgs max +- 8V, Id max = 25A, Pd max = 52W, Tj max = 33C/W
Q2250 = node4:FET_ZXMP6A17E6: ZXMP6A17E6 P-channel enhancement mode MOSFET
Q2251 Q2282 = node4:IC_BSS123: BSS123 N-Channel Enhancement Mode Logic Level MOSFET
R1-R6 R15 R281-R283 R289-R291 R2202-R2206 R2218 R2241 R2250-R2255 = rcl:R-US_: RESISTOR, American symbol
R7 R8 R2207-R2209 R2211-R2217 = resistor:R-US_: RESISTOR, American symbol
SJ280 SJ281 = node4:JUMPER_SJ2W: SMD solder JUMPER
TVS2201 = diode:ZENER-DIODE: Z-Diode
U282 = node4:IC_SN65220: SN65220 USB port transient suppressor
U2250 = node4:IC_MAX5902: MAX5902 Hot swap controller
U2251 = node4:IC_TLV3012: TLV3012 Nano power comparator with voltage reference
U$8 = 0kaz:IC_NC7NP14: Triple Inverter with Schmitt Trigger Input FairchildSemi http://www.fairchildsemi.com/ds/NC%2FNC7NP14.pdf
X281 = node4:XTAL_CS10: CS10 Surface mount crystal
X282 = node4:XTAL_CM415: CM415 Surface mount crystal